# EAGLE design PowerSupply (EAGLE 7.7.0)
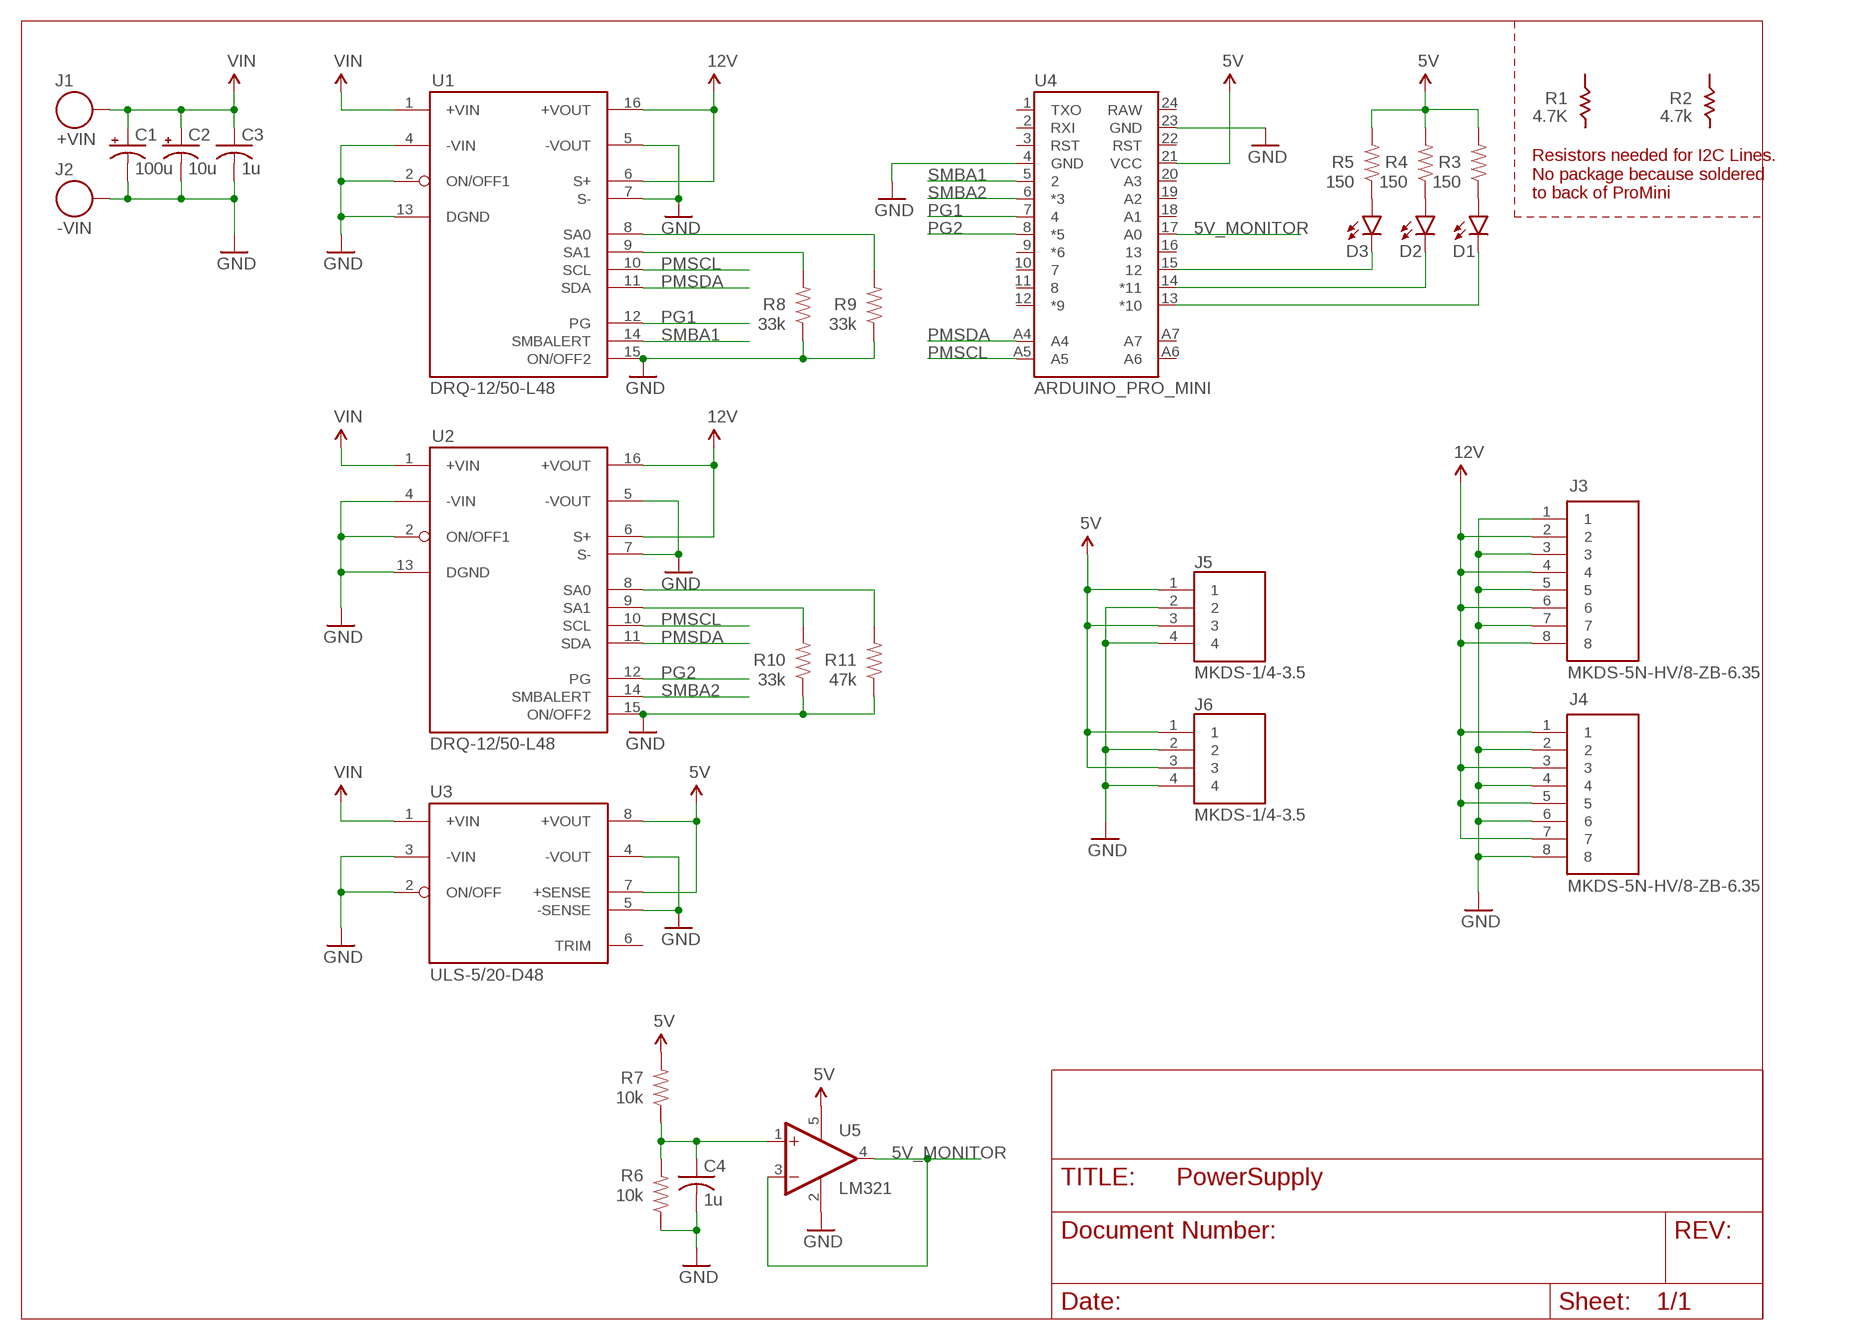
[diagram p0: schematic, sheet 1]

## Parts
C1  100u  CPOL-USE  [PANASONIC_E]
C2  10u  CPOL-USD  [PANASONIC_D]
C3  1u  C-USC0603  [C0603]
C4  1u  C-USC0603  [C0603]
D1  LED1206  [LED-1206]
D2  LED1206  [LED-1206]
D3  LED1206  [LED-1206]
J1  +VIN  SINGLE_PIN  [10AWG]
J2  -VIN  SINGLE_PIN  [10AWG]
J3  MKDS-5N-HV/8-ZB-6.35  [1777600]
J4  MKDS-5N-HV/8-ZB-6.35  [1777600]
J5  MKDS-1/4-3.5  [1751264]
J6  MKDS-1/4-3.5  [1751264]
R3  150  RESISTOR0603-RES  [0603-RES]
R4  150  RESISTOR0603-RES  [0603-RES]
R5  150  RESISTOR0603-RES  [0603-RES]
R6  10k  RESISTOR0603-RES  [0603-RES]
R7  10k  RESISTOR0603-RES  [0603-RES]
R8  33k  RESISTOR0603-RES  [0603-RES]
R9  33k  RESISTOR0603-RES  [0603-RES]
R10  33k  RESISTOR0603-RES  [0603-RES]
R11  47k  RESISTOR0603-RES  [0603-RES]
U1  DRQ-12/50-L48  [ABC(PMBUS)]
U2  DRQ-12/50-L48  [ABC(PMBUS)]
U3  ULS-5/20-D48  [1/16_BRICK_THROUGH_HOLE]
U4  ARDUINO_PRO_MINI  [ARDUINO_PRO_MINI]
U5  LM321  LM321MF  [SOT23-5]

## Nets
5V: J5.1 J5.3 J6.1 J6.3 R3.2 R4.2 R5.2 R7.2 U3.7(+SENSE) U3.8(+VOUT) U4.21(VCC) U5.5(V+)
5V_MONITOR: U4.17(A0) U5.3(-IN) U5.4(OUT)
12V: J3.2 J3.4 J3.6 J3.8 J4.1 J4.3 J4.5 J4.7 U1.6(S+) U1.16(+VOUT) U2.6(S+) U2.16(+VOUT)
GND: C1.- C2.- C3.2 C4.2 J2.P$1 J3.1 J3.3 J3.5 J3.7 J4.2 J4.4 J4.6 J4.8 J5.2 J5.4 J6.2 J6.4 R6.1 R8.1 R9.1 R10.1 R11.1 U1.2(ON/OFF1) U1.4(-VIN) U1.5(-VOUT) U1.7(S-) U1.13(DGND) U1.15(ON/OFF2) U2.2(ON/OFF1) U2.4(-VIN) U2.5(-VOUT) U2.7(S-) U2.13(DGND) U2.15(ON/OFF2) U3.2(ON/OFF) U3.3(-VIN) U3.4(-VOUT) U3.5(-SENSE) U4.4(GND) U4.23(GND) U5.2(V-)
N$1: R10.2 U2.9(SA1)
N$2: C4.1 R6.2 R7.1 U5.1(+IN)
N$4: R11.2 U2.8(SA0)
N$5: R8.2 U1.9(SA1)
N$6: R9.2 U1.8(SA0)
N$10: D3.C U4.15
N$11: D2.C U4.14(*11)
N$12: D1.C U4.13(*10)
N$13: D1.A R3.1
N$14: D2.A R4.1
N$15: D3.A R5.1
PG1: U1.12(PG) U4.7
PG2: U2.12(PG) U4.8(*5)
PMSCL: U1.10(SCL) U2.10(SCL) U4.A5
PMSDA: U1.11(SDA) U2.11(SDA) U4.A4
SMBA1: U1.14(SMBALERT) U4.5
SMBA2: U2.14(SMBALERT) U4.6(*3)
VIN: C1.+ C2.+ C3.1 J1.P$1 U1.1(+VIN) U2.1(+VIN) U3.1(+VIN)
Unconnected: U3.6(TRIM) U4.1(TXO) U4.2(RXI) U4.3(RST) U4.9(*6) U4.10 U4.11 U4.12(*9) U4.16 U4.18(A1) U4.19(A2) U4.20(A3) U4.22(RST) U4.24(RAW) U4.A6 U4.A7

## Notes on the sheet
- Resistors needed for I2C Lines.
  No package because soldered
  to back of ProMini

## Library data of the parts
C1 C2 = resistor:CPOL-US: POLARIZED CAPACITOR, American symbol
C3 C4 = resistor:C-US: CAPACITOR, American symbol
D1-D3 = SparkFun-LED:LED: LEDs Standard schematic elements and footprints for 5mm, 3mm, 1206, and 0603 sized LEDs. 5mm - Spark Fun Electronics SKU : COM-00529 (and others)
J1 J2 = PowerSupply:SINGLE_PIN
J3 J4 = PowerSupply:MKDS-5N-HV/8-ZB-6.35
J5 J6 = PowerSupply:MKDS-1/4-3.5
R3-R11 = SparkFun-Passives:RESISTOR: Resistor Basic schematic elements and footprints for 0603, 1206, and PTH resistors.
U1 U2 = PowerSupply:DRQ-12/50-L48: DRQ-12/50-L48 48VDC --> 12VDC power converter
U3 = PowerSupply:ULS-5/20-D48
U4 = SparkFun-Boards:ARDUINO_PRO_MINI
U5 = linear:LM321?*: Low Power Single Op Amp Source: http://cache.national.com/ds/LM/LM321.pdf

## Board
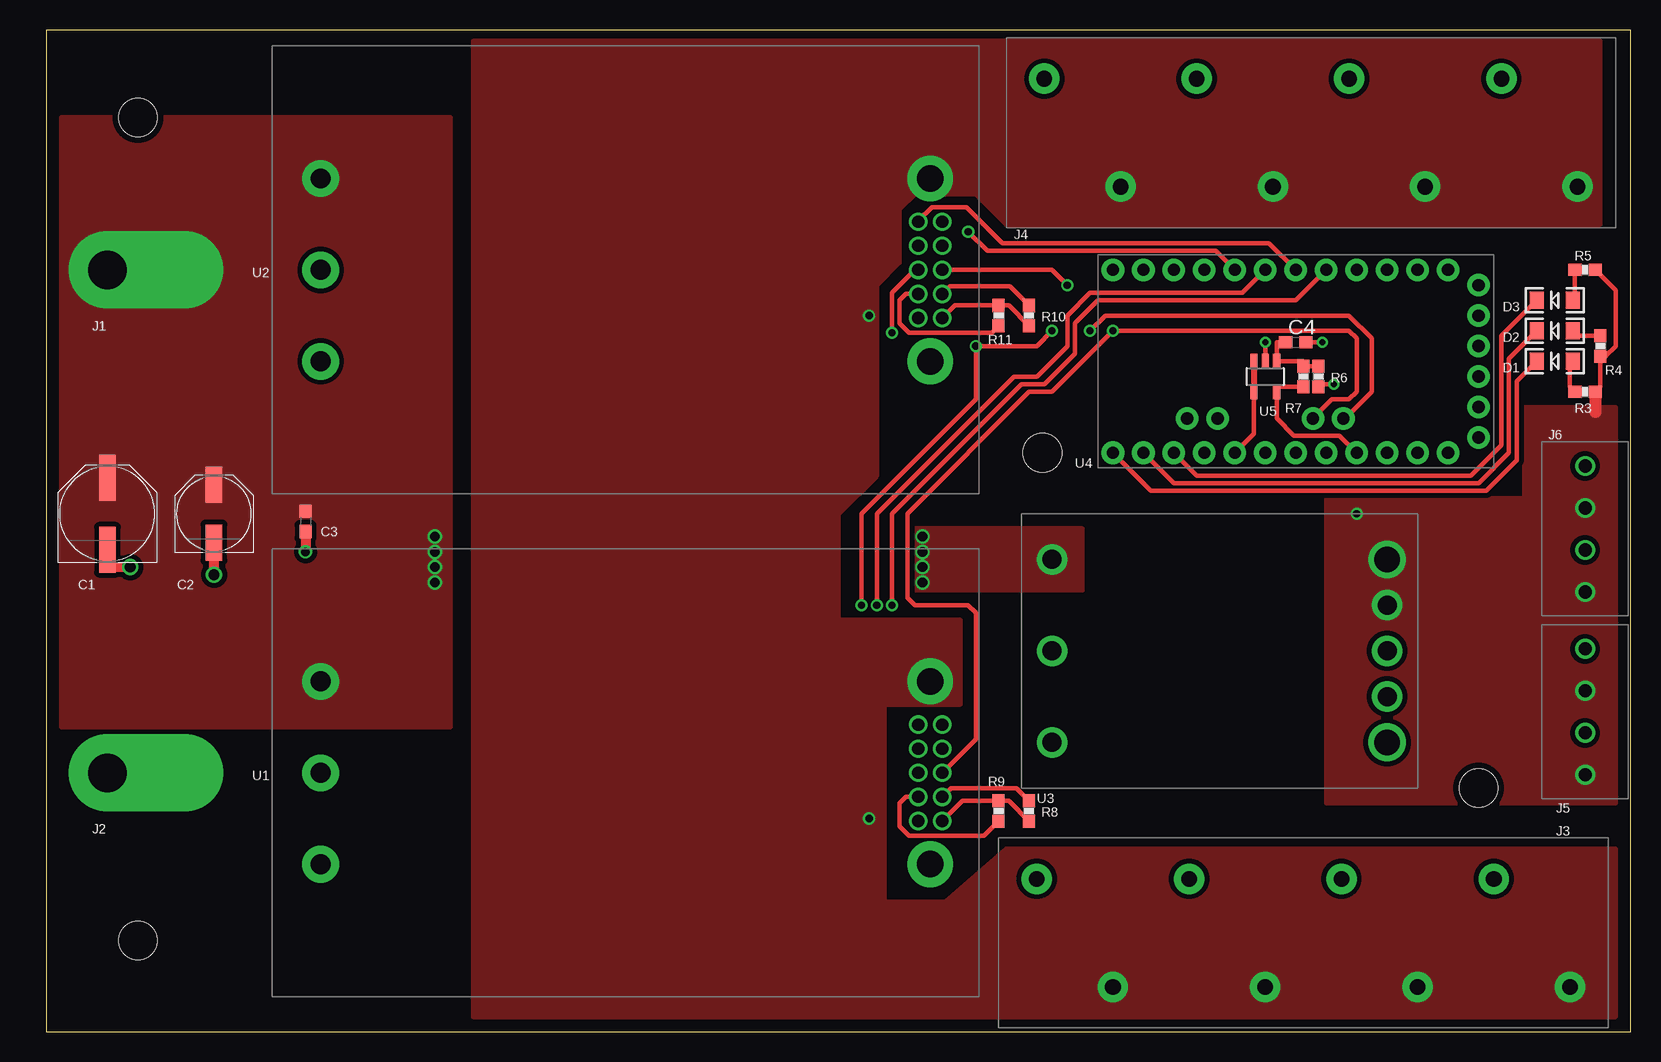
[diagram p1: board, top side]
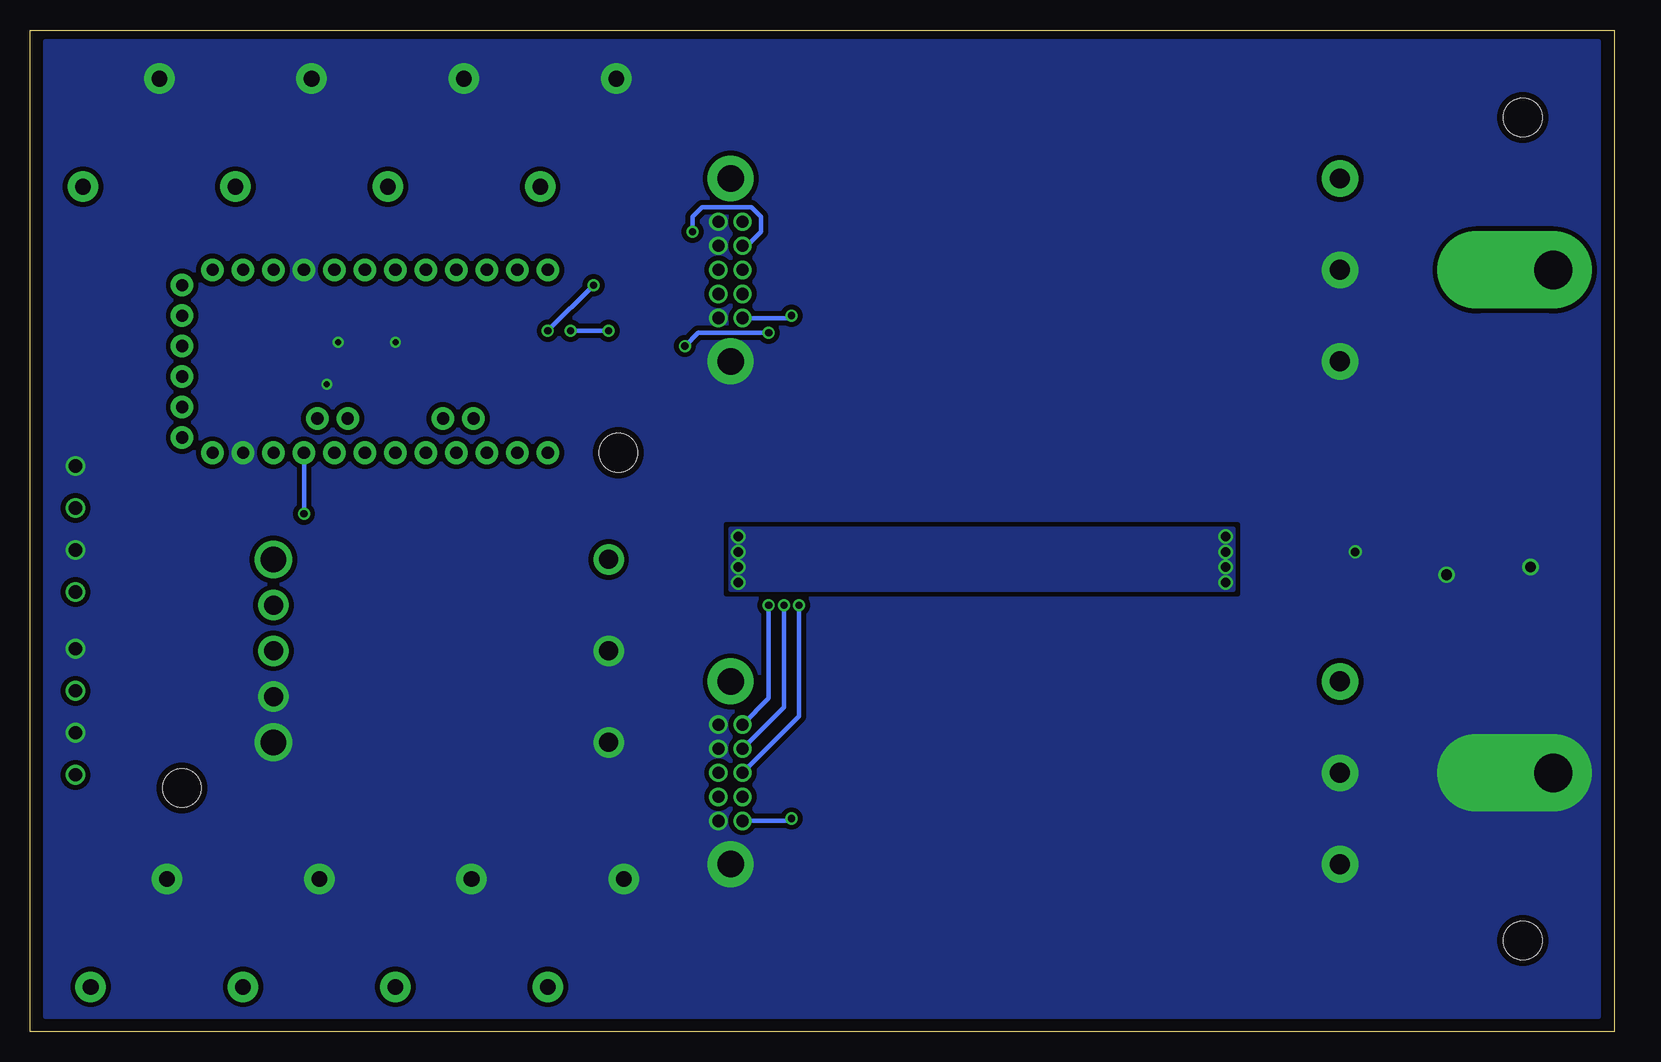
[diagram p2: board, bottom side, seen from below]

Size 132.06 x 83.49 mm. Coordinates in mm from the lower left corner, seen from the top.
Outline: 0,0 132.06,0 132.06,83.49 0,83.49 0,0
Copper layers (1*16): Top 0.035mm / dielectric 1.5mm / Bottom 0.035mm
Design rules "Advanced *": minimum track width 15mil, minimum drill 15mil, track to track 10mil, track to pad 10mil, pad to pad 10mil, via to via 10mil, smd to smd 10mil, copper to edge 20mil, drill to drill 10mil, minimum pad ring 10mil, minimum via ring 8mil, stop-mask expansion 4mil, vias tented up to drill 0mil, thermal gap 10mil
Holes 3.2 mm at 7.62,76.2 7.62,7.62 119.38,20.32 83.03,48.26

### Footprints (pad centres in the part's own frame; a part is rotated, then mirrored left to right if it is on the bottom)
PANASONIC_E = smd 3.8 x 1.4: + 3,0; - -3,0
PANASONIC_D = smd 3 x 1.4: + 2.4,0; - -2.4,0
C0603 = smd 1.1 x 1: 1 -0.85,0; 2 0.85,0
LED-1206 = smd 1.2 x 1.4: A -1.5,0; C 1.5,0
10AWG = drill 3.2 pad 6.452 offset: P$1 0,0
1777600 = drill 1.3 pad 2.54: 1 -22.225,4.5; 2 -15.875,-4.5; 3 -9.525,4.5; 4 -3.175,-4.5; 5 3.175,4.5; 6 9.525,-4.5; 7 15.875,4.5; 8 22.225,-4.5
1751264 = drill 1.1: 1 -5.25,0; 2 -1.75,0; 3 1.75,0; 4 5.25,0
0603-RES = smd 1.1 x 1: 1 -0.85,0; 2 0.85,0
ABC(PMBUS) = drill 1.651 pad 3.048: 1 -25.4,7.62; 2 -25.4,0; 4 -25.4,-7.62 | drill 2.21 pad 3.81: 5 25.4,-7.62; 16 25.4,7.62 | drill 1.016: 6 24.409,-4.013; 7 26.416,-4.013; 8 24.409,-2.007; 9 26.416,-2.007; 10 24.409,0; 11 26.416,0; 12 24.409,2.007; 13 26.416,2.007; 14 24.409,4.013; 15 26.416,4.013
1/16_BRICK_THROUGH_HOLE = drill 1.575 pad 2.54: 1 -13.97,7.62; 2 -13.97,0; 3 -13.97,-7.62; 5 13.97,-3.81; 6 13.97,0; 7 13.97,3.81 | drill 2.134: 4 13.97,-7.62; 8 13.97,7.62
ARDUINO_PRO_MINI = drill 1.016 pad 1.88: 1 -7.62,12.7; 2 -7.62,10.16; 3 -7.62,7.62; 4 -7.62,5.08; 5 -7.62,2.54; 6 -7.62,0; 7 -7.62,-2.54; 8 -7.62,-5.08; 9 -7.62,-7.62; 10 -7.62,-10.16; 11 -7.62,-12.7; 12 -7.62,-15.24; 13 7.62,-15.24; 14 7.62,-12.7; 15 7.62,-10.16; 16 7.62,-7.62; 17 7.62,-5.08; 18 7.62,-2.54; 19 7.62,0; 20 7.62,2.54; 21 7.62,5.08; 22 7.62,7.62; 23 7.62,10.16; 24 7.62,12.7; A4 4.763,1.429; A5 4.763,3.969; A6 4.763,-9.049; A7 4.763,-6.509; BLK -6.35,15.24; GND -3.81,15.24; GRN 6.35,15.24; RXI 1.27,15.24; TXO 3.81,15.24; VCC -1.27,15.24
SOT23-5 = smd 0.6 x 1.2: 1 -0.95,-1.306; 2 0,-1.306; 3 0.95,-1.306; 4 0.95,1.306; 5 -0.95,1.306

### Placement (x,y rotation side)
C1  5.08,43.18 90 top
C2  13.97,43.18 90 top
C3  21.59,42.55 270 top
C4  104.14,57.47 0 top
D1  125.73,55.88 180 top
D2  125.73,58.42 180 top
D3  125.73,60.96 180 top
J1  5.08,63.5 0 top
J2  5.08,21.59 0 top
J3  104.78,8.26 0 top
J4  105.41,74.93 180 top
J5  128.27,26.67 90 top
J6  128.27,41.91 90 top
R3  128.27,53.34 0 top
R4  129.54,57.15 270 top
R5  128.27,63.5 0 top
R6  106.05,54.61 90 top
R7  104.78,54.61 270 top
R8  81.92,18.41 90 top
R9  79.38,18.41 270 top
R10  81.92,59.69 90 top
R11  79.38,59.69 270 top
U1  48.26,21.59 0 top
U2  48.26,63.5 0 top
U3  97.79,31.75 0 top
U4  104.14,55.88 270 top
U5  101.6,54.61 180 top

### Tracks (layer width: path | path; a pad name or v marks a point on that pad's centre or on a via)
5V  (via drill 0.6)
  Top 0.381: R7.2 102.55,53.76 | U4.21 107.79,49.69 103.98,49.69 102.55,51.12 U5.5 | R5.2 130.81,61.81 130.81,57.15 129.96,56.3 | R4.2 129.54,53.76 R3.2 | 129.12,51.65 128.91,51.44
  Top 0.406: 102.55,53.76 U5.5 | 129.96,56.3 R4.2
  Top 1.016: R3.2 129.12,51.65
  Bottom 0.381: v109.22,43.18 U4.21
  pour Top (isolate 0.406, no thermals): 130.81,52.07 130.81,19.05 106.68,19.05 106.68,44.45 123.19,44.45 123.19,52.07
5V_MONITOR
  Top 0.381: U5.4 100.65,49.85 U4.17
  Top 0.406: 100.65,53.76 U5.4
  Top 0.508: U5.3 U5.4
12V  (via drill 0.6)
  Bottom 0.381: U2.6 69.01,59.49 v68.58,59.69 | U1.6 68.78,17.58 v68.58,17.78
  pour Top (isolate 0.406, no thermals): 71.12,68.58 72.39,69.85 77.47,69.85 80.01,67.31 129.54,67.31 129.54,82.55 35.56,82.55 35.56,1.27 130.81,1.27 130.81,15.24 80.01,15.24 74.93,10.79 69.85,10.79 69.85,27.3 76.2,27.3 76.2,34.29 66.04,34.29 66.04,43.18 69.22,46.35 69.22,62.23 71.12,64.14
GND  (via drill 0.5, 0.7, 0.9)
  Top 0.381: v101.6,57.47 U5.2 | R10.1 80.22,60.54 R11.1 75.73,60.54 U2.7 | U1.7 76.36,19.27 R9.1 80.22,19.27 R8.1 | C4.2 v106.36,57.47 | R6.1 106.26,53.98 v107.31,53.98
  Top 0.406: C1.- 5.08,41.27
  Top 0.813: v6.99,38.73 5.08,38.73 C1.- | v13.97,38.1 C2.- | C3.2 v21.59,40.01
  pour Bottom (isolate 0.406, rank 2, no thermals): 1.27,82.55 1.27,1.27 130.81,1.27 130.81,82.55 2.54,82.55
N$1
  Top 0.381: R10.2 80.33,62.13 75.31,62.13 U2.9
N$2
  Top 0.381: C4.1 102.55,57.47 U5.1 102.59,55.88 104.78,55.88 R7.1 R6.2
N$4
  Top 0.381: R11.2 78.8,58.26 71.91,58.26 71.12,59.05 71.12,60.96 71.65,61.49 U2.8
N$5
  Top 0.381: R8.2 80.86,20.32 75.41,20.32 U1.9
N$6
  Top 0.381: R9.2 78.16,16.35 71.91,16.35 71.12,17.14 71.12,19.05 71.65,19.58 U1.8
N$10
  Top 0.381: U4.15 95.89,46.35 118.75,46.35 121.28,48.9 121.28,58.02 D3.C
N$11
  Top 0.381: U4.14 93.98,45.72 119.38,45.72 121.92,48.26 121.92,56.11 D2.C
N$12
  Top 0.381: U4.13 92.08,45.09 120.02,45.09 122.56,47.62 122.56,54.2 D1.C
N$13
  Top 0.381: 127,55.65 127,53.76 R3.1
  Top 0.406: D1.A 127,55.65
N$14
  Top 0.381: 127.65,58 R4.1
  Top 0.406: D2.A 127.65,58
N$15
  Top 0.381: 127.42,61.15 R5.1
  Top 0.406: D3.A 127.42,61.15
PG1  (via drill 0.6)
  Top 0.381: U4.7 99.69,61.59 87,61.59 85.09,59.69 85.09,57.15 82.55,54.61 80.64,54.61 69.22,43.18 v69.22,35.56
  Bottom 0.381: v69.22,35.56 69.22,27.05 U1.12
PG2  (via drill 0.6)
  Top 0.381: U4.8 97.47,65.09 78.42,65.09 v76.83,66.67
  Bottom 0.381: v76.83,66.67 76.83,67.94 76.04,68.74 71.91,68.74 71.12,67.94 71.12,66.67 72.29,65.51 U2.12
PMSCL  (via drill 0.6)
  Top 0.381: 108.27,51.12 110.49,53.34 110.49,57.78 108.58,59.69 88.27,59.69 v87,58.42 | v67.94,35.56 67.94,43.18 77.47,52.7 v77.47,57.15 82.55,57.15 v83.82,58.42 | v70.48,58.26 70.48,61.59 72.39,63.5 U2.10
  Top 0.406: U4.A5 108.27,51.12
  Bottom 0.381: v67.94,35.56 67.94,26.31 U1.10 | v70.48,58.26 76.36,58.26 v77.47,57.15 | v83.82,58.42 v87,58.42
PMSDA  (via drill 0.6)
  Top 0.381: U4.A4 107.16,52.7 108.58,52.7 109.22,53.34 109.22,57.78 108.58,58.42 v88.9,58.42 83.82,53.34 81.92,53.34 71.75,43.18 71.75,36.2 72.39,35.56 76.83,35.56 77.47,34.92 77.47,24.38 U1.11 | v85.09,62.23 83.82,63.5 U2.11
  Bottom 0.381: v88.9,58.42 v85.09,62.23
SMBA1  (via drill 0.6)
  Top 0.381: v70.48,35.56 70.48,43.18 81.28,53.98 83.19,53.98 85.72,56.52 85.72,59.05 87.63,60.96 104.14,60.96 U4.5
  Bottom 0.381: v70.48,35.56 70.48,27.79 U1.14
SMBA2
  Top 0.381: U4.6 101.92,65.72 79.69,65.72 76.68,68.74 73.82,68.74 72.67,67.59 U2.14
VIN  (via drill 0.8)
  other vias: 73.03,37.47 73.03,38.73 73.03,40.01 73.03,41.27 32.38,41.27 32.38,40.01 32.38,38.73 32.38,37.47
  pour Top (isolate 0.406, no thermals): 1.27,76.2 33.66,76.2 33.66,25.4 1.27,25.4
  pour Top (isolate 0.406, no thermals): 86.36,41.91 72.39,41.91 72.39,36.83 86.36,36.83
  pour Bottom (isolate 0.406, no thermals): 73.66,41.91 73.66,36.83 31.75,36.83 31.75,41.91